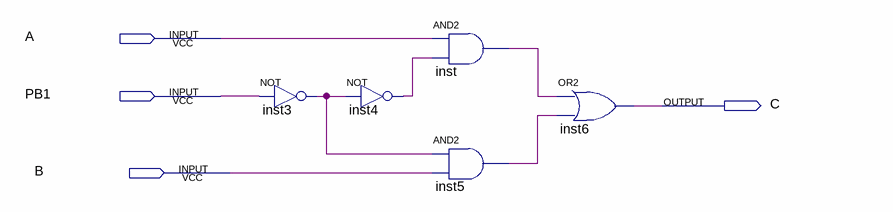
[diagram p0: schematic sheet]
// Quartus schematic MULTIPLEXADOR.bdf as structural Verilog: 5 symbols, 4 pins
module MULTIPLEXADOR (
  input  A,
  input  PB1,
  input  B,
  output C
);

  wire inst3_out, inst4_out, inst5_out, inst_out;

  not inst3 (inst3_out, PB1);
  not inst4 (inst4_out, inst3_out);
  and inst (inst_out, A, inst4_out);
  and inst5 (inst5_out, inst3_out, B);
  or inst6 (C, inst_out, inst5_out);
endmodule
